# Altium schematic sheet M.2 E&M Key.SchDoc
size 594 x 420 mm
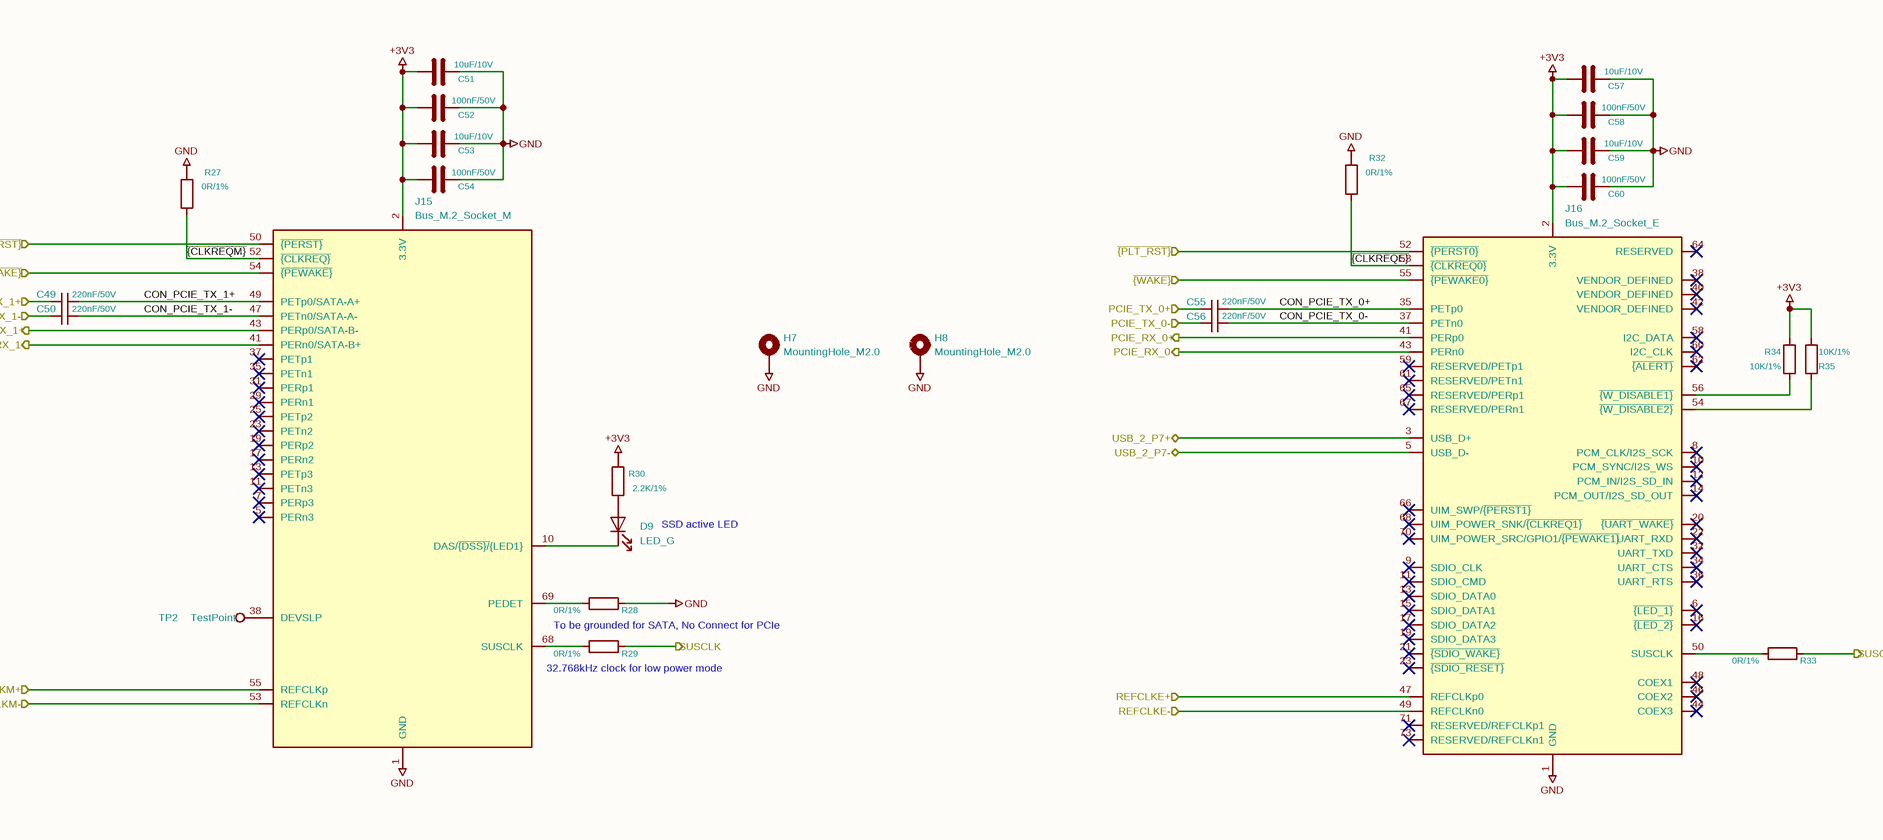
[diagram p0: M.2 E&M Key.SchDoc]

## Parts
C49  220nF/50V  [C_0402_1005Metric]
C50  220nF/50V  [C_0402_1005Metric]
C51  10uF/10V  [C_0402_1005Metric]
C52  100nF/50V  [C_0402_1005Metric]
C53  10uF/10V  [C_0402_1005Metric]
C54  100nF/50V  [C_0402_1005Metric]
C55  220nF/50V  [C_0402_1005Metric]
C56  220nF/50V  [C_0402_1005Metric]
C57  10uF/10V  [C_0402_1005Metric]
C58  100nF/50V  [C_0402_1005Metric]
C59  10uF/10V  [C_0402_1005Metric]
C60  100nF/50V  [C_0402_1005Metric]
D9  LED_G  [LED_0603_1608Metric]
H7  MountingHole_M2.0  [MountingHole_2.75mm_M2_4.4mm_Pad_TopOnly]
H8  MountingHole_M2.0  [MountingHole_2.75mm_M2_4.4mm_Pad_TopOnly]
J15  Bus_M.2_Socket_M  [PCIe_M.2_Connectors_P=0.5mm_H=4.2mm_KeyM]
J16  Bus_M.2_Socket_E  [PCIe_M.2_Connectors_P=0.5mm_H=4.2mm_KeyE]
R27  0R/1%  [R_0402_1005Metric]
R28  0R/1%  [R_0402_1005Metric]
R29  0R/1%  [R_0402_1005Metric]
R30  2.2K/1%  [R_0402_1005Metric]
R32  0R/1%  [R_0402_1005Metric]
R33  0R/1%  [R_0402_1005Metric]
R34  10K/1%  [R_0402_1005Metric]
R35  10K/1%  [R_0402_1005Metric]
TP2  TestPoint  [TestPoint_Pad_D1.5mm]

## Ports
PCIE_RX_0+ (out), PCIE_RX_0- (out), PCIE_RX_1+ (out), PCIE_RX_1- (out), PCIE_TX_0+ (in), PCIE_TX_0- (in), PCIE_TX_1+ (in), PCIE_TX_1- (in), REFCLKE+ (in), REFCLKE- (in), REFCLKM+ (in), REFCLKM- (in), SUSCLK (out), USB_2_P7+ (bidir), USB_2_P7- (bidir), ~{{PLT_RST}} (in), ~{{WAKE}} (in)

## Nets
+3V3: C51.2 C52.2 C53.2 C54.2 C57.2 C58.2 C59.2 C60.2 J15.2(3.3V) J16.2(3.3V) R30.2 R34.2 R35.1
GND: C51.1 C52.1 C53.1 C54.1 C57.1 C58.1 C59.1 C60.1 H7.1 H8.1 J15.1(GND) J16.1(GND) R27.2 R28.2 R32.2
CON_PCIE_TX_0+: C55.2 J16.35(PETp0)
CON_PCIE_TX_0-: C56.2 J16.37(PETn0)
CON_PCIE_TX_1+: C49.2 J15.49(PETp0/SATA-A+)
CON_PCIE_TX_1-: C50.2 J15.47(PETn0/SATA-A-)
PCIE_RX_0+: J16.41(PERp0) ; port PCIE_RX_0+
PCIE_RX_0-: J16.43(PERn0) ; port PCIE_RX_0-
PCIE_RX_1+: J15.43(PERp0/SATA-B-) ; port PCIE_RX_1+
PCIE_RX_1-: J15.41(PERn0/SATA-B+) ; port PCIE_RX_1-
PCIE_TX_0+: C55.1 ; port PCIE_TX_0+
PCIE_TX_0-: C56.1 ; port PCIE_TX_0-
PCIE_TX_1+: C49.1 ; port PCIE_TX_1+
PCIE_TX_1-: C50.1 ; port PCIE_TX_1-
REFCLKE+: J16.47(REFCLKp0) ; port REFCLKE+
REFCLKE-: J16.49(REFCLKn0) ; port REFCLKE-
REFCLKM+: J15.55(REFCLKp) ; port REFCLKM+
REFCLKM-: J15.53(REFCLKn) ; port REFCLKM-
SUSCLK: R29.2 R33.2 ; port SUSCLK
USB_2_P7+: J16.3(USB_D+) ; port USB_2_P7+
USB_2_P7-: J16.5(USB_D-) ; port USB_2_P7-
~{{CLKREQE}}: J16.53(~{{CLKREQ0}}) R32.1
~{{CLKREQM}}: J15.52(~{{CLKREQ}}) R27.1
~{{PLT_RST}}: J15.50(~{{PERST}}) J16.52(~{{PERST0}}) ; port ~{{PLT_RST}}
~{{WAKE}}: J15.54(~{{PEWAKE}}) J16.55(~{{PEWAKE0}}) ; port ~{{WAKE}}
NetD9_1: D9.1(K) J15.10(DAS/~{{DSS}/}{LED1})
NetD9_2: D9.2(A) R30.1
NetJ15_38: J15.38(DEVSLP) TP2.1
NetJ15_68: J15.68(SUSCLK) R29.1
NetJ15_69: J15.69(PEDET) R28.1
NetJ16_50: J16.50(SUSCLK) R33.1
NetJ16_54: J16.54(~{{W_DISABLE2}}) R35.2
NetJ16_56: J16.56(~{{W_DISABLE1}}) R34.1

Not connected (* = marked no-connect by the designer): J15 3(GND) 4(3.3V) 5(PERn3)* 6(NC) 7(PERp3)* 8(NC) 9(GND) 11(PETn3)* 12(3.3V) 13(PETp3)* 14(3.3V) 15(GND) 16(3.3V) 17(PERn2)* 18(3.3V) 19(PERp2)* 20(NC) 21(GND) 22(NC) 23(PETn2)* 24(NC) 25(PETp2)* 26(NC) 27(GND) 28(NC) 29(PERn1)* 30(NC) 31(PERp1)* 32(NC) 33(GND) 34(NC) 35(PETn1)* 36(NC) 37(PETp1)* 39(GND) 40(NC) 42(NC) 44(NC) 45(GND) 46(NC) 48(NC) 51(GND) 56(NC) 57(GND) 58(NC) 67(NC) 70(3.3V) 71(GND) 72(3.3V) 73(GND) 74(3.3V) 75(GND) MP1 MP2; J16 4(3.3V) 6(~{{LED_1}})* 7(GND) 8(PCM_CLK/I2S_SCK)* 9(SDIO_CLK)* 10(PCM_SYNC/I2S_WS)* 11(SDIO_CMD)* 12(PCM_IN/I2S_SD_IN)* 13(SDIO_DATA0)* 14(PCM_OUT/I2S_SD_OUT)* 15(SDIO_DATA1)* 16(~{{LED_2}})* 17(SDIO_DATA2)* 18(GND) 19(SDIO_DATA3)* 20(~{{UART_WAKE}})* 21(~{{SDIO_WAKE}})* 22(UART_RXD)* 23(~{{SDIO_RESET}})* 32(UART_TXD)* 33(GND) 34(UART_CTS)* 36(UART_RTS)* 38(VENDOR_DEFINED)* 39(GND) 40(VENDOR_DEFINED)* 42(VENDOR_DEFINED)* 44(COEX3)* 45(GND) 46(COEX2)* 48(COEX1)* 51(GND) 57(GND) 58(I2C_DATA)* 59(RESERVED/PETp1)* 60(I2C_CLK)* 61(RESERVED/PETn1)* 62(~{{ALERT}})* 63(GND) 64(RESERVED)* 65(RESERVED/PERp1)* 66(UIM_SWP/~{{PERST1}})* 67(RESERVED/PERn1)* 68(UIM_POWER_SNK/~{{CLKREQ1}})* 69(GND) 70(UIM_POWER_SRC/GPIO1/~{{PEWAKE1}})* 71(RESERVED/REFCLKp1)* 72(3.3V) 73(RESERVED/REFCLKn1)* 74(3.3V) 75(GND) MP1 MP2

## Notes on the sheet
- SSD active LED
- To be grounded for SATA, No Connect for PCIe
- 32.768kHz clock for low power mode
- 1
- 2
- 3
- 4
- 5
- 6
- 7
- 8
- 9
- 10
- 11
- A
- B
- C
- D
- E
- F
- G
- H
- Title: Primer Carrier for LattePanda Mu
- File: M.2 E&M Key.kicad_sch
- Sheet: /
- DFRobot
- KiCad E.D.A.  kicad (5.1.4)-1
- Size: A2
- Date: 2024-03-13
- Rev: V1.0.0
- Id: 1/1

## Library data of the parts
C49 C50 C55 C56 = C_Small: SCH_Show_Footprint: C0402; Value: 220nF/50V; Footprint: A_HDJ_Library:C_0402_1005Metric
C51-C54 C57-C60 = C: SCH_Show_Footprint: C0402; Footprint: A_HDJ_Library:C_0402_1005Metric
  C51 C53 C57 C59: Value: 10uF/10V
  C52 C54 C58 C60: Value: 100nF/50V
D9 = LED: SCH_Show_Footprint: LED0603; Value: LED_G; Footprint: A_HDJ_Library:LED_0603_1608Metric
H7 H8 = MountingHole_Pad: Value: MountingHole_M2.0; Footprint: A_HDJ_Library:MountingHole_2.75mm_M2_4.4mm_Pad_TopOnly
R27-R30 R32-R35 = R
  R27 R29 R32 R33: Value: 0R/1%; Footprint: A_HDJ_Library:R_0402_1005Metric
  R28: Value: 0R/1%; Footprint: Resistor_SMD:R_0402_1005Metric
  R30: Value: 2.2K/1%; Footprint: A_HDJ_Library:R_0402_1005Metric
  R34 R35: Value: 10K/1%; Footprint: A_HDJ_Library:R_0402_1005Metric
J15 = Bus_M.2_Socket_M: Value: Bus_M.2_Socket_M; Footprint: A_HDJ_Library:PCIe_M.2_Connectors_P=0.5mm_H=4.2mm_KeyM
J16 = Bus_M.2_Socket_E: Value: Bus_M.2_Socket_E; Footprint: A_HDJ_Library:PCIe_M.2_Connectors_P=0.5mm_H=4.2mm_KeyE
TP2 = TestPoint: Value: TestPoint; Footprint: A_HDJ_Library:TestPoint_Pad_D1.5mm